# EAGLE design main (EAGLE 5.11)
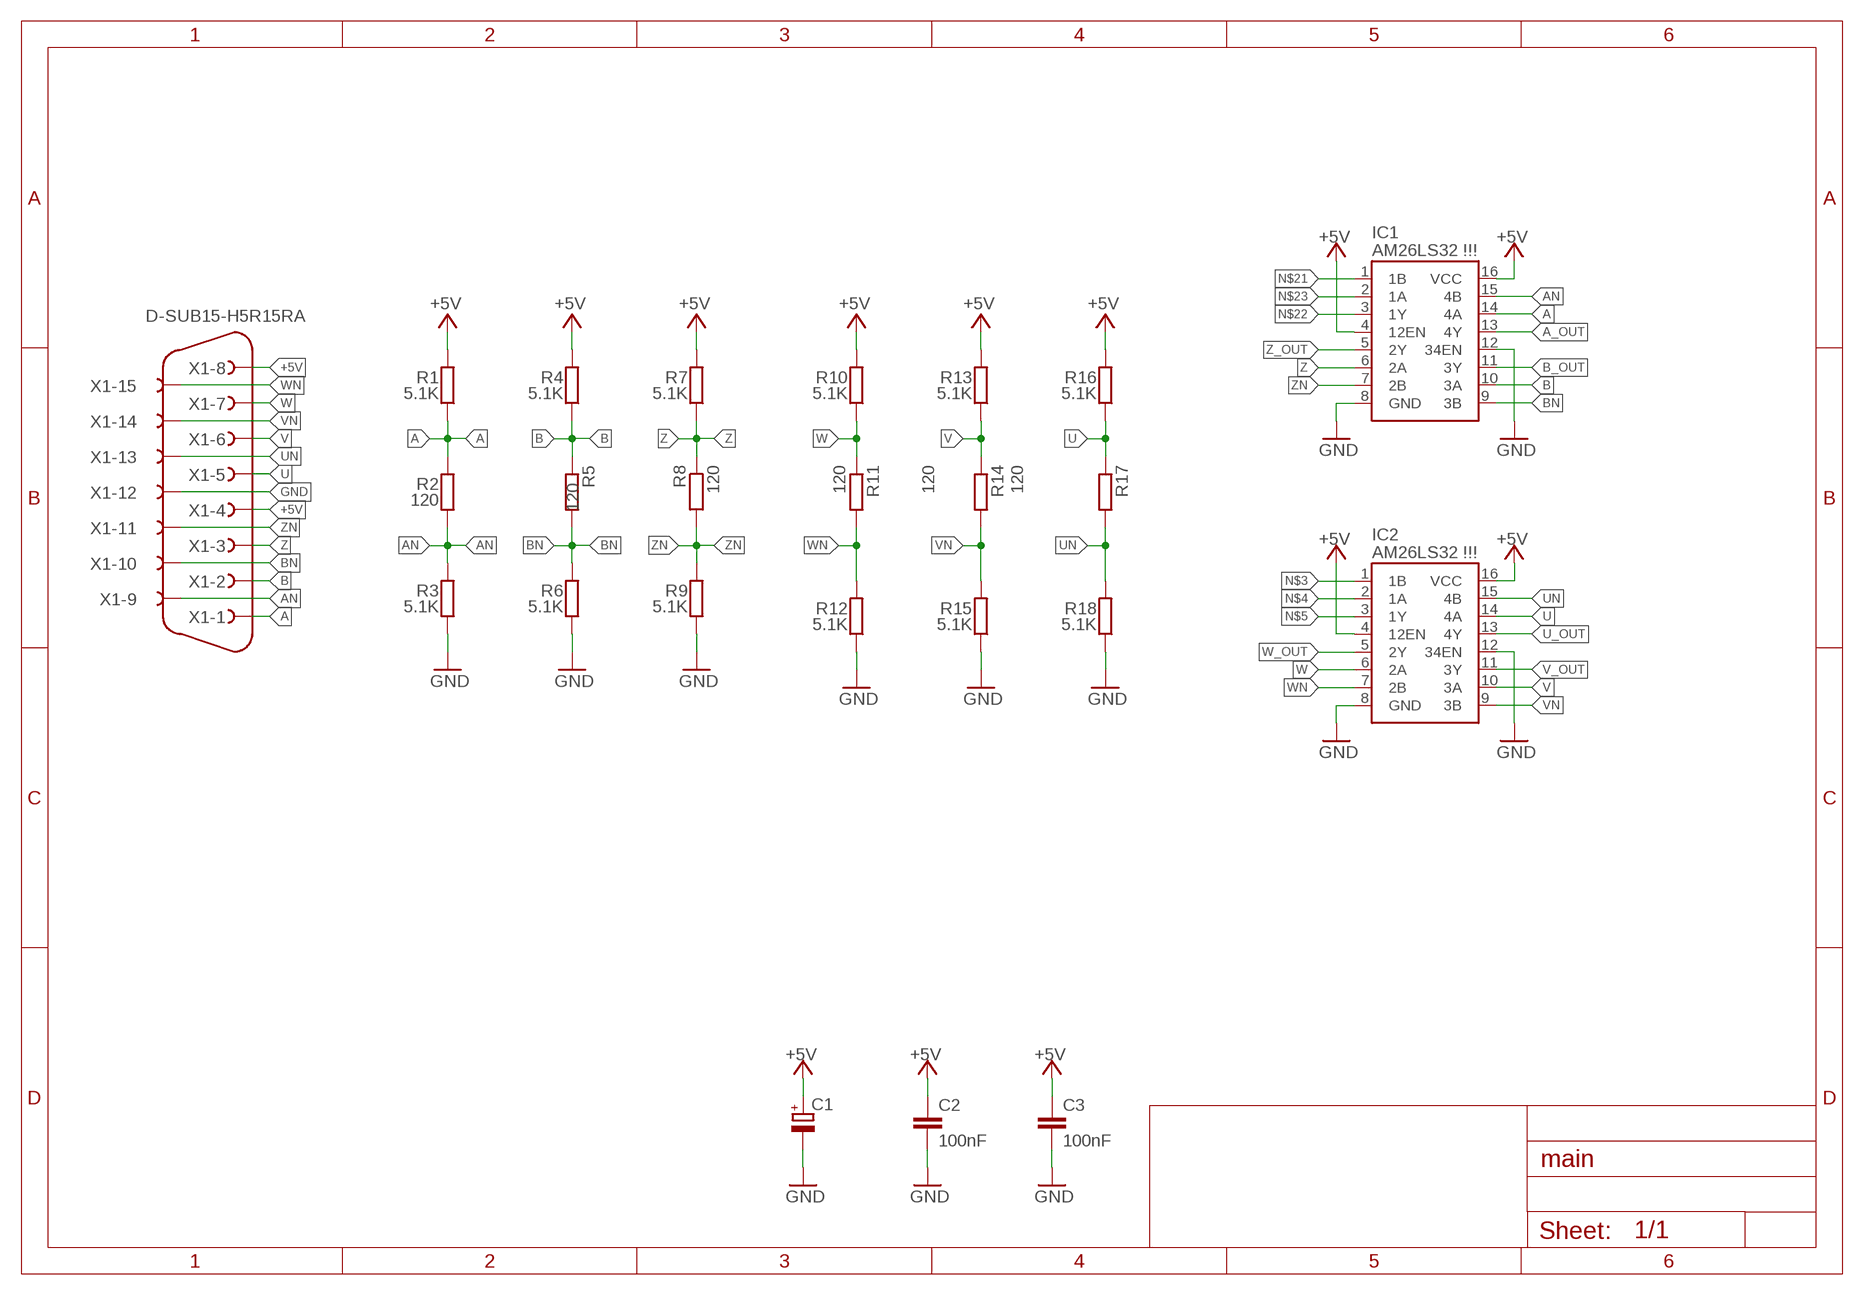
[diagram p0: schematic, sheet 1]

## Parts
C1  CPOL-EUE3.5-8  [E3,5-8]
C2  100nF  C-EUC0805  [C0805]
C3  100nF  C-EUC0805  [C0805]
IC1  AM26LS32 !!!  SN7175N  [DIL16]
IC2  AM26LS32 !!!  SN7175N  [DIL16]
R1  5.1K  R-EU_R0603  [R0603]
R2  120  R-EU_R1206  [R1206]
R3  5.1K  R-EU_R0603  [R0603]
R4  5.1K  R-EU_R0603  [R0603]
R5  120  R-EU_R1206  [R1206]
R6  5.1K  R-EU_R0603  [R0603]
R7  5.1K  R-EU_R0603  [R0603]
R8  120  R-EU_R1206  [R1206]
R9  5.1K  R-EU_R0603  [R0603]
R10  5.1K  R-EU_R0603  [R0603]
R11  120  R-EU_R1206  [R1206]
R12  5.1K  R-EU_R0603  [R0603]
R13  5.1K  R-EU_R0603  [R0603]
R14  120  R-EU_R1206  [R1206]
R15  5.1K  R-EU_R0603  [R0603]
R16  5.1K  R-EU_R0603  [R0603]
R17  120  R-EU_R1206  [R1206]
R18  5.1K  R-EU_R0603  [R0603]
X1  D-SUB15-H5R15RA  [H5R15RA]

## Nets
+5V: C1.+ C2.1 C3.1 IC1.4(12EN) IC1.16(VCC) IC2.4(12EN) IC2.16(VCC) R1.2 R4.2 R7.2 R10.2 R13.2 R16.2 X1.4 X1.8
A: IC1.14(4A) R1.1 R2.1 X1.1
A_OUT: IC1.13(4Y)
AN: IC1.15(4B) R2.2 R3.2 X1.9
B: IC1.10(3A) R4.1 R5.1 X1.2
B_OUT: IC1.11(3Y)
BN: IC1.9(3B) R5.2 R6.2 X1.10
GND: C1.- C2.2 C3.2 IC1.8(GND) IC1.12(34EN) IC2.8(GND) IC2.12(34EN) R3.1 R6.1 R9.1 R12.1 R15.1 R18.1 X1.12
N$3: IC2.1(1B)
N$4: IC2.2(1A)
N$5: IC2.3(1Y)
N$21: IC1.1(1B)
N$22: IC1.3(1Y)
N$23: IC1.2(1A)
U: IC2.14(4A) R16.1 R17.1 X1.5
U_OUT: IC2.13(4Y)
UN: IC2.15(4B) R17.2 R18.2 X1.13
V: IC2.10(3A) R13.1 R14.1 X1.6
V_OUT: IC2.11(3Y)
VN: IC2.9(3B) R14.2 R15.2 X1.14
W: IC2.6(2A) R10.1 R11.1 X1.7
W_OUT: IC2.5(2Y)
WN: IC2.7(2B) R11.2 R12.2 X1.15
Z: IC1.6(2A) R7.1 R8.1 X1.3
Z_OUT: IC1.5(2Y)
ZN: IC1.7(2B) R8.2 R9.2 X1.11

## Library data of the parts
C1 = rcl:CPOL-EU: POLARIZED CAPACITOR, European symbol
C2 C3 = rcl:C-EU: CAPACITOR, European symbol
IC1 IC2 = myIC:SN7175*
R1-R18 = rcl:R-EU_: RESISTOR, European symbol
X1 = con-thomas-betts:D-SUB15-: D-Subminiatur Connector Source: Electronioc Interconnects European Edition 1998; MF: TYCO ELECTRONICS; MPN: H5R15RA29B; OC_FARNELL: unknown; OC_NEWARK: 93F8335

## Board
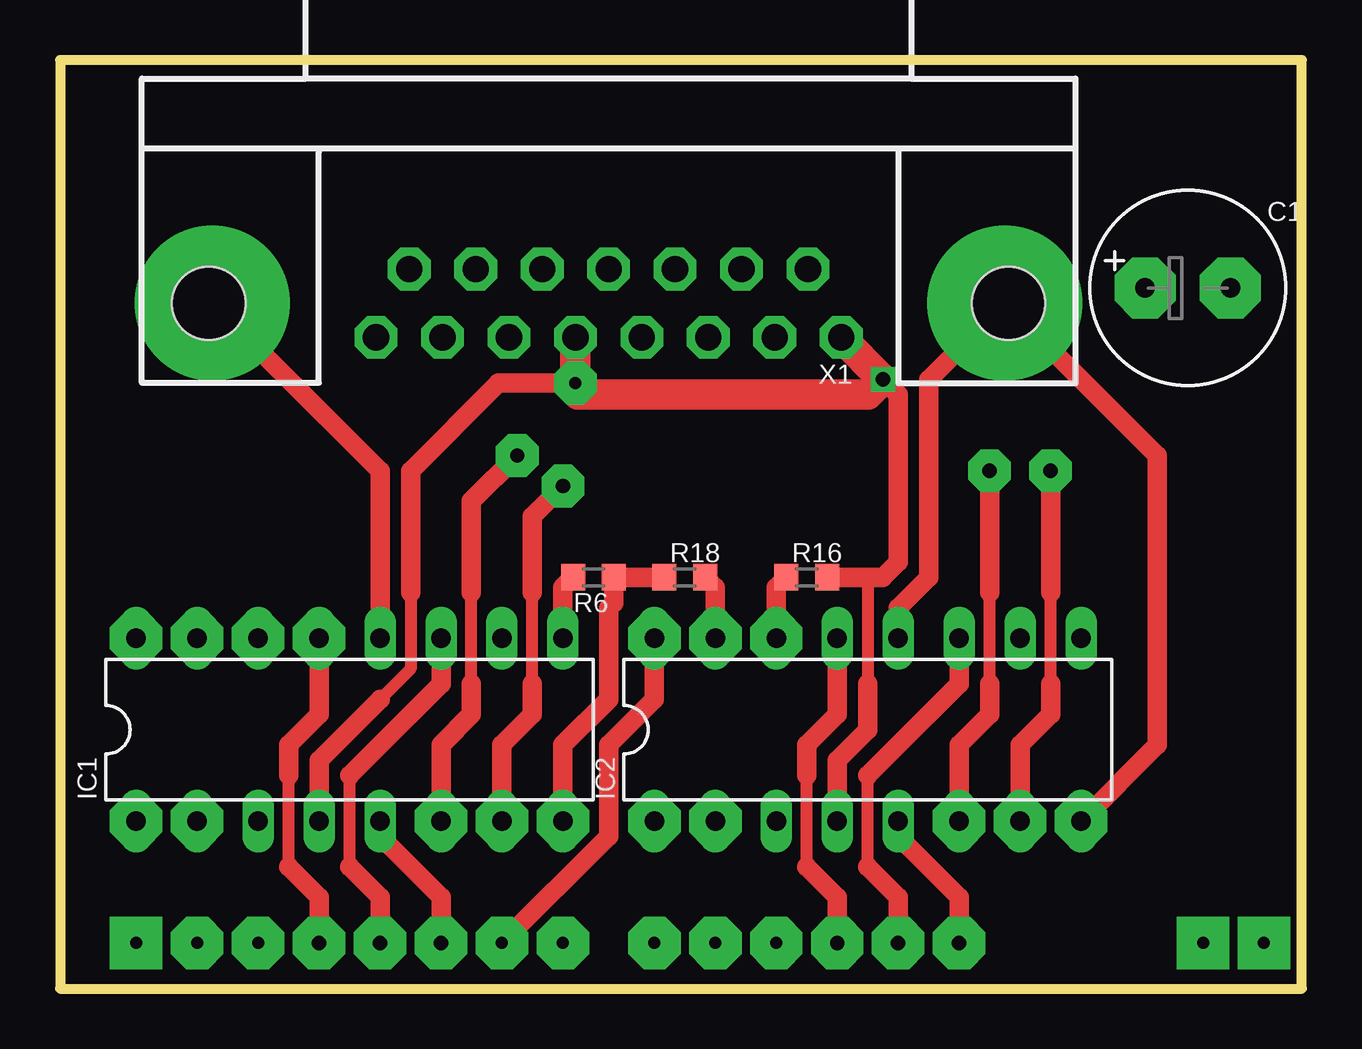
[diagram p1: board, top side]
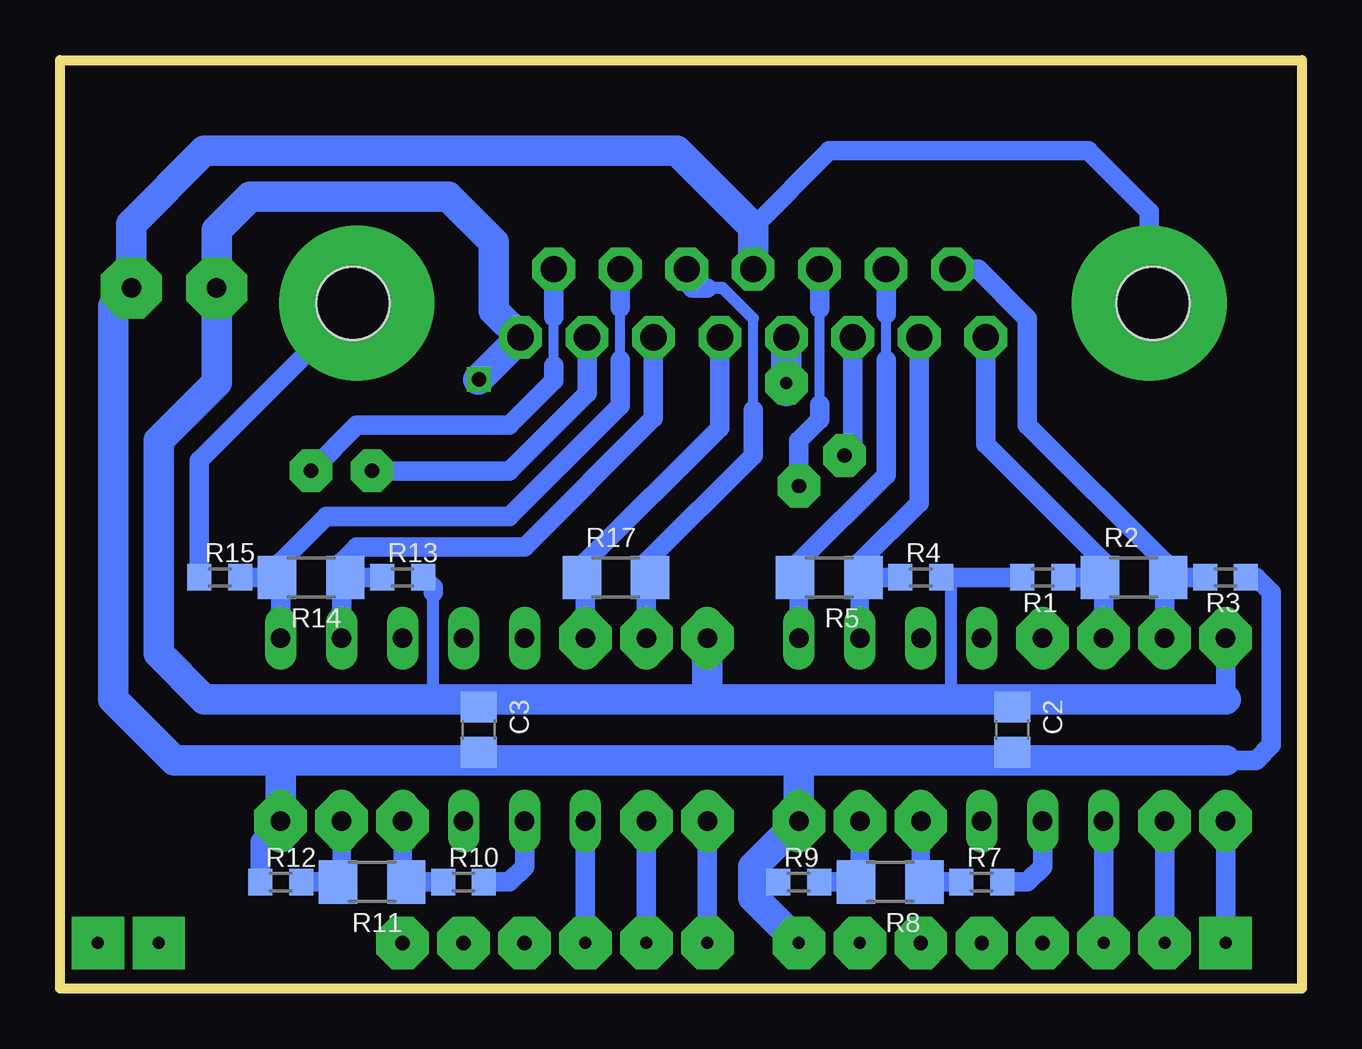
[diagram p2: board, bottom side, seen from below]

Size 51.74 x 38.72 mm. Coordinates in mm from the lower left corner, seen from the top.
Outline: 0,0 51.74,0 51.74,38.72 0,38.72 0,0
Copper layers (1*16): Top 0.035mm / dielectric 1.5mm / Bottom 0.035mm
Design rules "default": minimum track width 10mil, minimum drill 24mil, track to track 8mil, track to pad 8mil, pad to pad 8mil, via to via 8mil, smd to smd 8mil, copper to edge 40mil, drill to drill 8mil, minimum pad ring 10mil, minimum via ring 8mil, stop-mask expansion 4mil, vias tented up to drill 0mil, thermal gap 10mil

### Footprints (pad centres in the part's own frame; a part is rotated, then mirrored left to right if it is on the bottom)
E3,5-8 = drill 0.813 pad 1.6 round: + -1.778,0 | drill 0.813 pad 1.6 octagon: - 1.778,0
C0805 = smd 1.3 x 1.5: 1 -0.95,0; 2 0.95,0
DIL16 = drill 0.813 long: 1 -8.89,-3.81; 2 -6.35,-3.81; 3 -3.81,-3.81; 4 -1.27,-3.81; 5 1.27,-3.81; 6 3.81,-3.81; 7 6.35,-3.81; 8 8.89,-3.81; 9 8.89,3.81; 10 6.35,3.81; 11 3.81,3.81; 12 1.27,3.81; 13 -1.27,3.81; 14 -3.81,3.81; 15 -6.35,3.81; 16 -8.89,3.81
R0603 = smd 1 x 1.1: 1 -0.85,0; 2 0.85,0
R1206 = smd 1.6 x 1.803: 1 -1.422,0; 2 1.422,0
H5R15RA = drill 1.092 round: 1 9.69,1.422; 2 6.921,1.422; 3 4.153,1.422; 4 1.384,1.422; 5 -1.384,1.422; 6 -4.153,1.422; 7 -6.921,1.422; 8 -9.69,1.422; 9 8.306,-1.422; 10 5.537,-1.422; 11 2.769,-1.422; 12 0,-1.422; 13 -2.769,-1.422; 14 -5.537,-1.422; 15 -8.306,-1.422 | hole 3.048: -16.662,0; 16.662,0

### Placement (x,y rotation side)
C1  46.99,29.21 0 top
C2  12.06,10.79 270 bottom
C3  34.29,10.79 270 bottom
IC1  12.06,10.79 0 top
IC2  33.66,10.79 0 top
R1  10.79,17.14 180 bottom
R2  6.99,17.14 0 bottom
R3  3.17,17.14 180 bottom
R4  15.88,17.14 0 bottom
R5  19.68,17.14 180 bottom
R6  22.23,17.14 180 top
R7  13.34,4.45 0 bottom
R8  17.14,4.45 180 bottom
R9  20.95,4.45 0 bottom
R10  34.92,4.45 0 bottom
R11  38.73,4.45 180 bottom
R12  42.55,4.45 0 bottom
R13  37.47,17.14 0 bottom
R14  41.27,17.14 180 bottom
R15  45.09,17.14 0 bottom
R16  31.11,17.14 0 top
R17  28.57,17.14 0 bottom
R18  26.04,17.14 0 top
X1  22.86,28.57 180 top

### Tracks (layer width: path | path; a pad name or v marks a point on that pad's centre or on a via)
+5V  (via drill 0.5 pad 1.27, 0.5 pad 1.78, 0.5 pad 2.18, 0.5 pad 2.54, 0.6)
  Top 0.508: 13.34,12.06 14.61,13.34 14.61,16.51 | 33.66,17.14 33.66,12.7
  Top 0.813: v10.79,6.99 10.79,9.53 13.34,12.06 | v32.38,6.99 32.38,9.53 33.66,10.79 33.66,12.7 | IC2.16 24.77,12.06 22.86,10.16 22.86,6.35 v18.41,1.91 | R16.2 33.66,17.14 34.29,17.14 34.92,17.78 34.92,24.77 v34.29,25.4 | 14.61,16.51 14.61,21.59 18.26,25.25 v21.48,25.25
  Top 1.27: X1.8 v34.29,25.4 33.66,24.77 21.59,24.77 21.48,24.88 v21.48,25.25 X1.4
  Bottom 0.406: 34.29,12.06 C3.1
  Bottom 0.508: 13.34,17.14 14.61,17.14 14.61,12.06 | 36.2,12.06 36.2,16.51
  Bottom 0.813: 3.17,12.06 IC1.16 | R7.2 11.43,4.45 10.79,5.08 v10.79,6.99 | R1.2 13.34,17.14 R4.2 | R10.2 33.02,4.45 32.38,5.08 v32.38,6.99 | R13.2 36.2,16.73 36.2,16.51
  Bottom 1.27: 3.17,12.06 12.06,12.06 | 12.06,12.06 14.61,12.06 24.77,12.06 | 24.77,12.06 34.29,12.06 36.2,12.06 45.72,12.06 47.62,13.97 47.62,22.86 45.21,25.27 C1.+ 45.21,31.62 43.81,33.02 35.56,33.02 33.67,31.13 33.67,28.27 X1.8 34.3,25.4 | 24.77,12.06 IC2.16 | 12.06,12.06 C2.1 | 21.48,24.92 v21.48,25.25 21.48,27.3
  other vias: 3.17,14.61 24.77,14.61 21.48,27.15 32.55,27.15 45.21,29.21
A  (via drill 0.5 pad 1.78, 0.5 pad 2.18)
  Bottom 0.762: 8.26,17.14 R2.1
  Bottom 0.813: X1.1 13.17,22.7 8.26,17.78 8.26,17.14 v8.26,14.61 | R2.1 R1.1
  other vias: 13.17,27.15
A_OUT  (via drill 0.6 pad 2.18)
  Top 0.508: 9.53,5.08 9.53,8.89
  Top 0.813: IC1.13 10.79,11.43 9.53,10.16 9.53,8.89 | 9.53,5.08 10.79,3.81 v10.79,1.91
AN  (via drill 0.5 pad 1.78, 0.5 pad 2.18)
  Bottom 0.813: X1.9 13.49,30 11.43,27.94 11.43,23.5 5.71,17.78 5.71,17.14 | IC1.15 5.71,17.14 | 5.71,17.14 R2.2 R3.2
  other vias: 5.71,14.61 14.55,30
B  (via drill 0.5 pad 1.27, 0.5 pad 1.78)
  Bottom 0.762: IC1.10 18.41,17.14 R5.1
  Bottom 0.813: X1.2 15.94,20.26 18.41,17.78 18.41,17.14 | R5.1 R4.1
  other vias: 18.41,14.61 15.94,27.15
B_OUT  (via drill 0.6 pad 2.18)
  Top 0.508: 12.06,5.08 12.06,8.89
  Top 0.813: IC1.11 15.88,12.7 12.06,8.89 | 12.06,5.08 13.34,3.81 v13.34,1.91
BN  (via drill 0.5 pad 1.27, 0.5 pad 1.78)
  Top 0.813: R6.2 20.95,16.73 IC1.9
  Bottom 0.406: 17.32,26.21 17.32,28.12
  Bottom 0.762: IC1.9 20.95,17.14 R5.2
  Bottom 0.813: 17.32,28.12 X1.10 | 17.32,26.21 17.32,21.41 20.95,17.78 20.95,17.14
  other vias: 20.95,14.61 17.32,30
GND  (via drill 0.5 pad 1.27, 0.5 pad 1.78, 0.5 pad 2.18, 0.5 pad 2.54, 0.5 pad 6.45)
  Top 0.813: v42.55,6.99 45.72,10.16 45.72,22.23 v39.37,28.57 36.2,25.4 36.2,17.14 34.92,15.88 v34.92,14.61 | v20.95,6.99 20.95,10.16 22.86,12.06 22.86,15.88 23.07,16.09 R6.1 R18.1 | v13.34,14.61 13.34,21.59 v6.35,28.57
  Bottom 0.406: 34.29,9.53 C3.2
  Bottom 0.813: v6.35,28.57 6.35,32.38 8.89,34.92 19.68,34.92 22.86,31.75 | 22.86,4.45 R9.1 | R15.1 45.94,22.01 v39.37,28.57 | R3.1 1.91,17.14 1.27,16.51 1.27,10.16 1.91,9.53 3.17,9.53 | R12.1 43.4,6.13 v42.55,6.99
  Bottom 1.27: 20.95,9.53 v20.95,6.99 22.86,5.08 22.86,4.45 22.86,3.81 v20.95,1.91 | 3.17,9.53 12.06,9.53 | 12.06,9.53 20.95,9.53 | 20.95,9.53 34.29,9.53 42.55,9.53 | 42.55,9.53 v42.55,6.99 | 12.06,9.53 C2.2 | X1.12 22.86,31.75 26.04,34.92 45.72,34.92 48.77,31.88 C1.- 49.53,28.45 49.53,12.06 46.99,9.53 42.55,9.53
  other vias: 22.86,30 48.77,29.21
N$1  (via drill 0.5 pad 2.18)
  other vias: 47.62,1.91
N$2  (via drill 0.5 pad 2.18)
  other vias: 10.79,14.61
N$6  (via drill 0.5 pad 2.18)
  other vias: 50.16,1.91
N$9  (via drill 0.5 pad 1.27, 0.5 pad 2.18)
  Bottom 0.813: v8.26,1.91 v8.26,6.99
N$10  (via drill 0.5 pad 1.27)
  other vias: 13.34,6.99
N$14  (via drill 0.5 pad 1.27)
  other vias: 34.92,6.99
N$15  (via drill 0.5 pad 1.27)
  other vias: 32.38,14.61
N$16  (via drill 0.5 pad 1.27)
  other vias: 37.47,14.61
N$17  (via drill 0.5 pad 1.27)
  other vias: 15.88,14.61
N$25  (via drill 0.5 pad 2.18)
  Bottom 0.813: v3.17,1.91 v3.17,6.99
N$26  (via drill 0.5 pad 2.18)
  Bottom 0.813: v5.71,1.91 v5.71,6.99
N$29  (via drill 0.5 pad 2.18)
  Bottom 0.813: v24.77,1.91 v24.77,6.99
N$31  (via drill 0.5 pad 2.18)
  Bottom 0.813: v27.3,1.91 v27.3,6.99
N$32  (via drill 0.5 pad 1.27, 0.5 pad 2.18)
  Bottom 0.813: v29.84,1.91 v29.84,6.99
U  (via drill 0.5 pad 1.78, 0.5 pad 2.18)
  Top 0.813: R16.1 29.84,16.73 v29.84,14.61
  Bottom 0.813: 29.84,15.88 v29.84,14.61 29.84,17.14 | X1.5 24.24,23.38 29.84,17.78 29.84,17.14 | 29.84,17.14 R17.1
  other vias: 24.24,27.15
U_OUT  (via drill 0.6 pad 2.18)
  Top 0.508: 31.11,5.08 31.11,8.89
  Top 0.813: IC2.13 32.38,11.43 31.11,10.16 31.11,8.89 | 31.11,5.08 32.38,3.81 v32.38,1.91
UN  (via drill 0.5 pad 1.78, 0.5 pad 2.18)
  Top 0.813: IC2.15 27.3,16.73 R18.2
  Bottom 0.406: 23.65,28.73 22.86,27.94 22.86,24.13
  Bottom 0.508: 24.77,29.21 24.13,29.21 22.86,27.94
  Bottom 0.813: IC2.15 27.3,17.14 | 27.3,17.14 27.3,17.78 22.86,22.23 22.86,24.13 | 27.3,17.14 R17.2 | X1.13 25.63,29.44 25.4,29.21 24.77,29.21
  other vias: 27.3,14.61 25.63,30
V  (via drill 0.5 pad 1.27, 0.5 pad 1.78)
  Bottom 0.762: 40.01,17.78 40.01,17.14
  Bottom 0.813: X1.6 27.01,23.79 32.38,18.41 39.37,18.41 40.01,17.78 | IC2.10 40.01,17.14 R14.1 R13.1
  other vias: 40.01,14.61 27.01,27.15
V_OUT  (via drill 0.6 pad 2.18)
  Top 0.508: 33.66,5.08 33.66,8.89
  Top 0.813: IC2.11 37.47,12.7 33.66,8.89 | 33.66,5.08 34.92,3.81 v34.92,1.91
VN  (via drill 0.5 pad 1.27, 0.5 pad 1.78)
  Bottom 0.406: 28.4,26.21 28.4,28.4
  Bottom 0.762: 42.55,17.14 R14.2
  Bottom 0.813: IC2.9 42.55,17.14 42.55,17.78 40.64,19.68 33.02,19.68 28.4,24.31 28.4,26.21 | 28.4,28.4 X1.14 | R14.2 R15.2
  other vias: 42.55,14.61 28.4,30
W  (via drill 0.5 pad 1.78, 0.5 pad 2.18, 0.6 pad 1.78)
  Top 0.508: 38.73,12.7 38.73,16.51
  Top 0.813: v37.47,6.99 37.47,10.16 38.73,11.43 38.73,12.7 | 38.73,16.51 v38.73,21.59
  Bottom 0.762: v37.47,6.99 37.47,4.6 R11.1
  Bottom 0.813: X1.7 29.78,24.83 33.02,21.59 v38.73,21.59 | R10.1 R11.1
  other vias: 29.78,27.15
W_OUT  (via drill 0.6 pad 2.18)
  Top 0.813: v37.47,1.91 37.47,3.81 34.92,6.35 IC2.5
WN  (via drill 0.5 pad 1.78, 0.5 pad 2.18, 0.6 pad 1.78)
  Top 0.508: 41.27,12.7 41.27,16.51
  Top 0.813: v40.01,6.99 40.01,10.16 41.27,11.43 41.27,12.7 | 41.27,16.51 v41.27,21.59
  Bottom 0.406: 31.17,25.98 31.17,27.99
  Bottom 0.762: v40.01,6.99 40.01,4.6 R11.2
  Bottom 0.813: v41.27,21.59 39.37,23.5 33.02,23.5 31.17,25.35 31.17,25.98 | 31.17,27.99 X1.15 | R12.2 R11.2
  other vias: 31.17,30
Z  (via drill 0.5 pad 1.78, 0.5 pad 2.18, 0.6 pad 1.78)
  Top 0.508: 17.14,12.7 17.14,16.51
  Top 0.813: v15.88,6.99 15.88,10.16 17.14,11.43 17.14,12.7 | 17.14,16.51 17.14,20.32 v19.05,22.23
  Bottom 0.762: v15.88,6.99 15.88,4.6 R8.1
  Bottom 0.813: X1.3 18.71,22.52 v19.05,22.23 | R7.1 R8.1
  other vias: 18.71,27.15
Z_OUT  (via drill 0.6 pad 2.18)
  Top 0.813: v15.88,1.91 15.88,3.81 13.34,6.35 IC1.5
ZN  (via drill 0.5 pad 1.78, 0.5 pad 2.18, 0.6 pad 1.78)
  Top 0.508: 19.68,12.7 19.68,16.51
  Top 0.813: v18.41,6.99 18.41,10.16 19.68,11.43 19.68,12.7 | 19.68,16.51 19.68,19.68 v20.95,20.95
  Bottom 0.406: 20.09,24.36 20.09,28.35
  Bottom 0.762: v18.41,6.99 18.41,4.6 R8.2
  Bottom 0.813: 20.09,28.35 X1.11 | v20.95,20.95 20.95,22.86 20.09,23.72 20.09,24.36 | R8.2 R9.2
  other vias: 20.09,30